# Altium schematic sheet 15 ETHERNET.SchDoc
size 420 x 297 mm; Address1: Address1; Address2: Address2; Address3: Address3; Address4: Address4; DocumentNumber: АБВГ.123456.001 Э3; SheetNumber: 15; SheetTotal: 23; Scale: 1:1; DocumentType: Схема электрическая принципиальная; FirstReferrence: АБВГ.123456.001
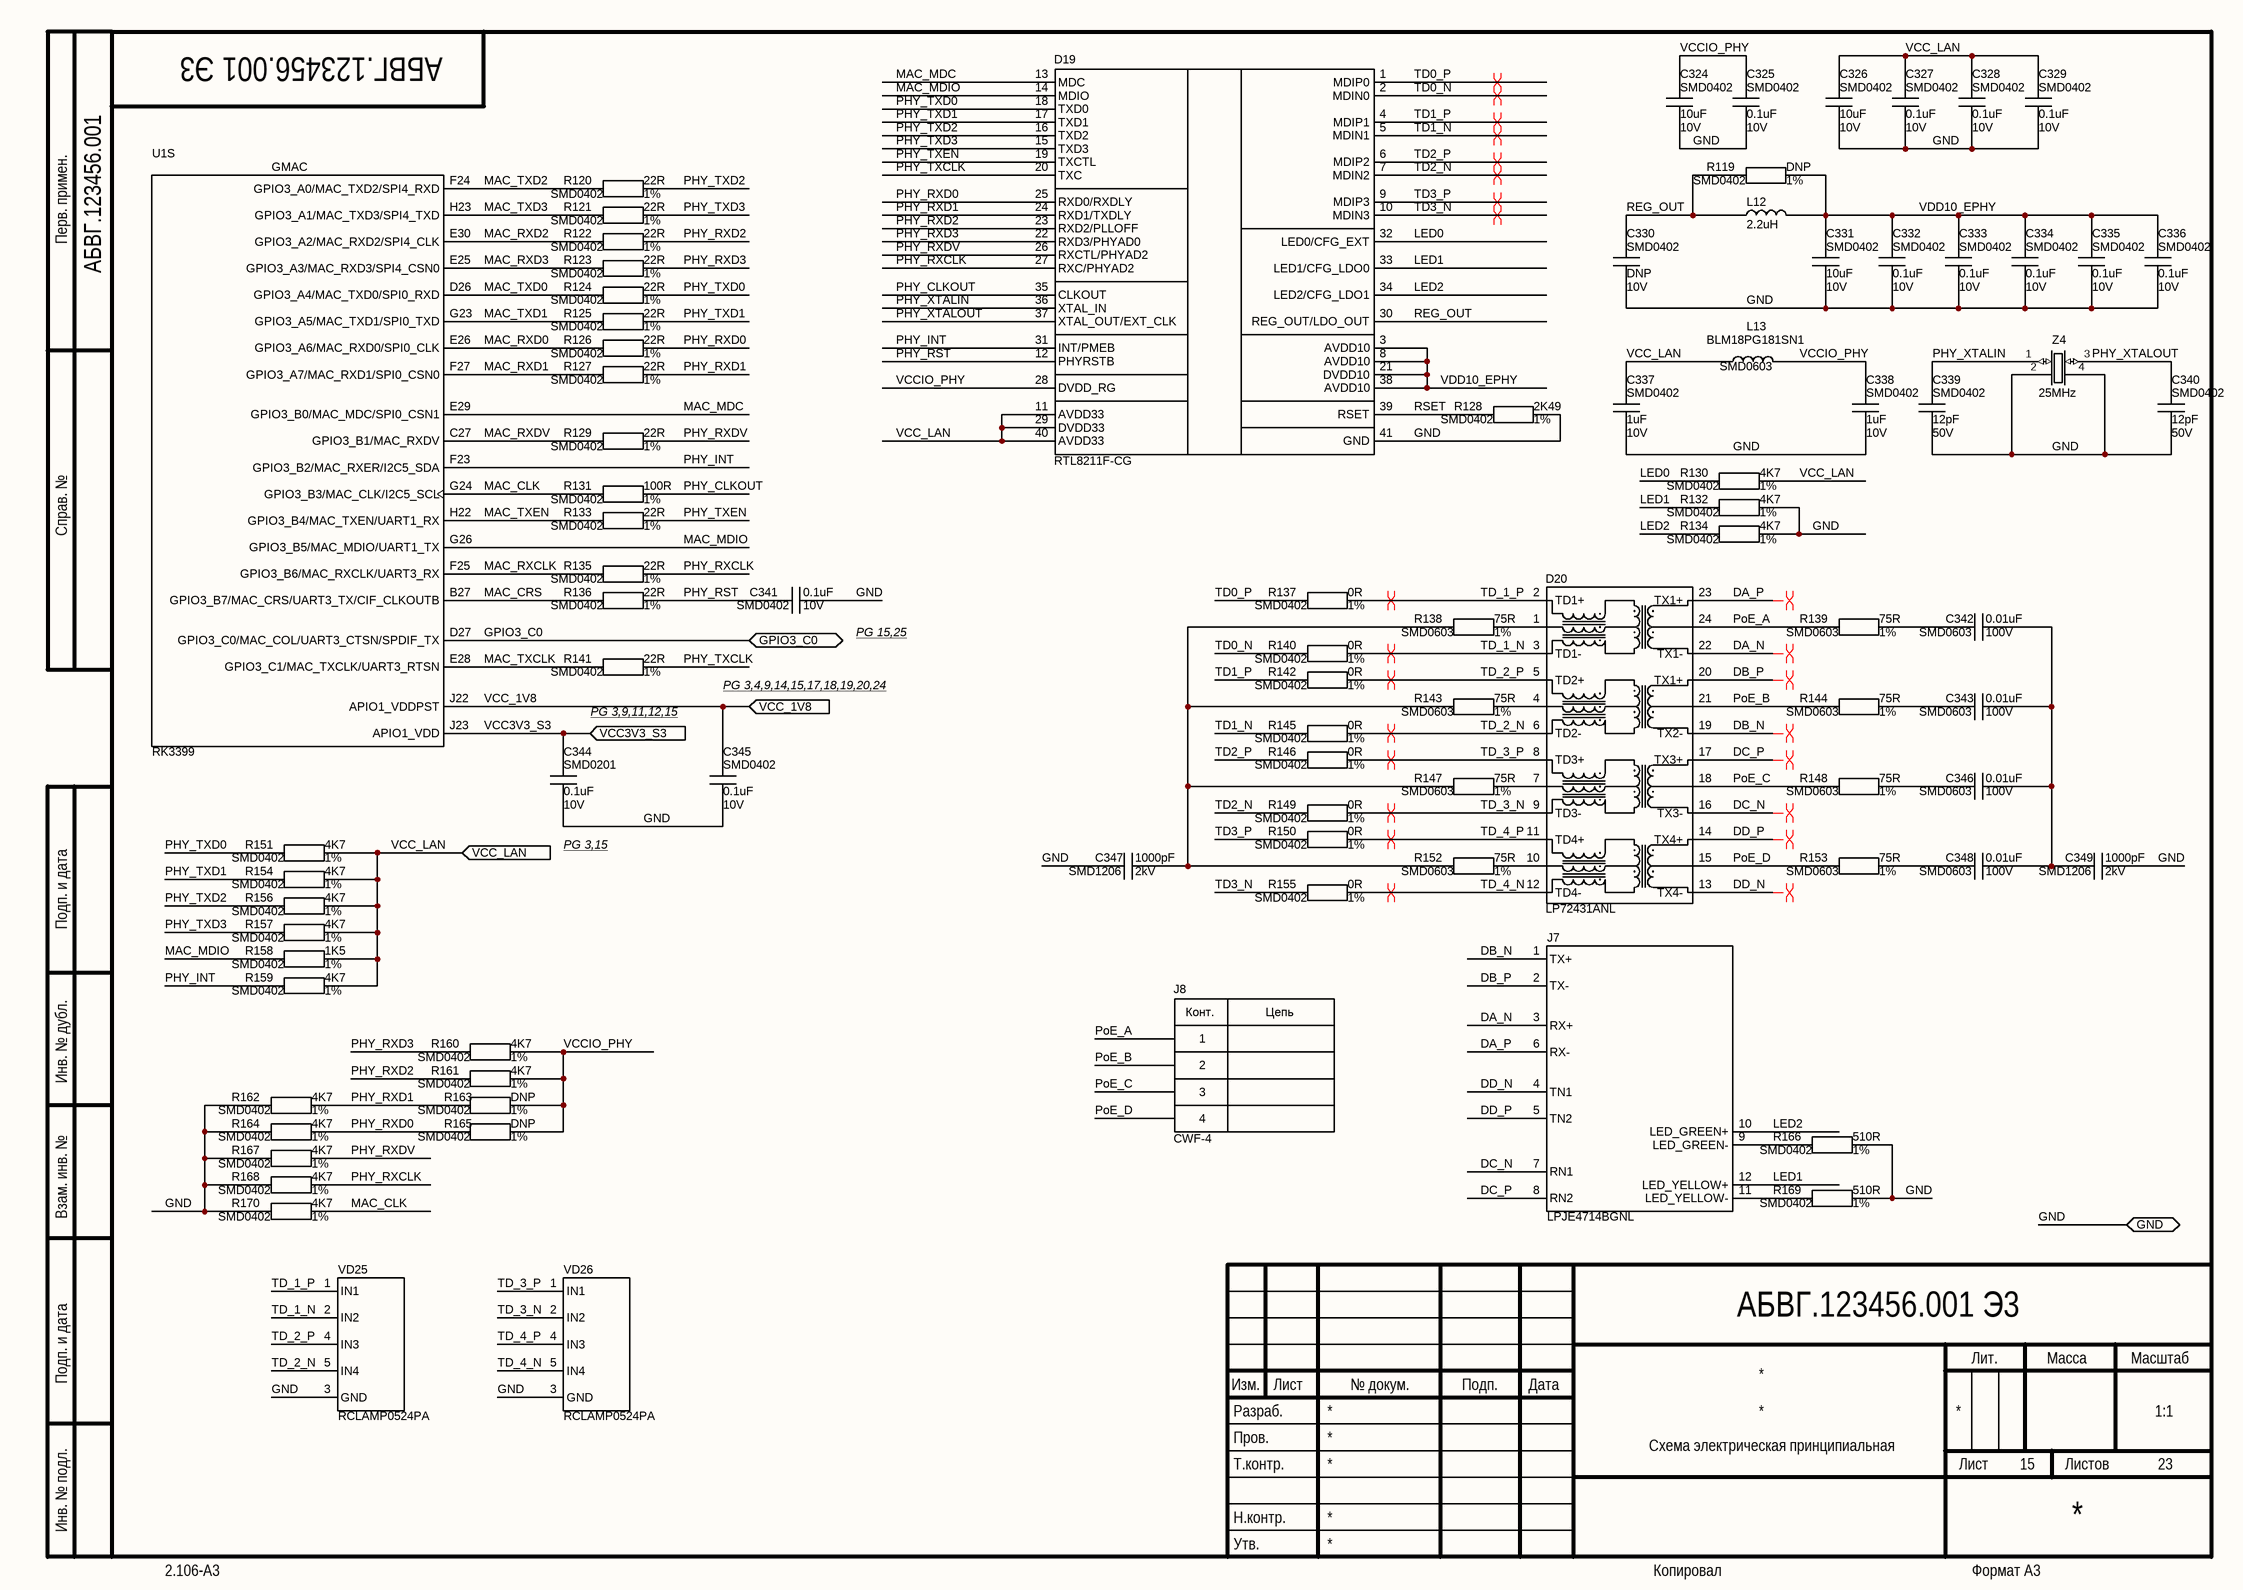
[diagram p0: 15 ETHERNET.SchDoc]

## Parts
C324  Package: SMD0402  Voltage: 10V  [CAP_SMD_0402]  (hidden comment: 10uF)
C325  Package: SMD0402  Voltage: 10V  [CAP_SMD_0402]  (hidden comment: 0.1uF)
C326  Package: SMD0402  Voltage: 10V  [CAP_SMD_0402]  (hidden comment: 10uF)
C327  Package: SMD0402  Voltage: 10V  [CAP_SMD_0402]  (hidden comment: 0.1uF)
C328  Package: SMD0402  Voltage: 10V  [CAP_SMD_0402]  (hidden comment: 0.1uF)
C329  Package: SMD0402  Voltage: 10V  [CAP_SMD_0402]  (hidden comment: 0.1uF)
C330  Package: SMD0402  Voltage: 10V  [CAP_SMD_0402]  (hidden comment: DNP)
C331  Package: SMD0402  Voltage: 10V  [CAP_SMD_0402]  (hidden comment: 10uF)
C332  Package: SMD0402  Voltage: 10V  [CAP_SMD_0402]  (hidden comment: 0.1uF)
C333  Package: SMD0402  Voltage: 10V  [CAP_SMD_0402]  (hidden comment: 0.1uF)
C334  Package: SMD0402  Voltage: 10V  [CAP_SMD_0402]  (hidden comment: 0.1uF)
C335  Package: SMD0402  Voltage: 10V  [CAP_SMD_0402]  (hidden comment: 0.1uF)
C336  Package: SMD0402  Voltage: 10V  [CAP_SMD_0402]  (hidden comment: 0.1uF)
C337  Package: SMD0402  Voltage: 10V  [CAP_SMD_0402]  (hidden comment: 1uF)
C338  Package: SMD0402  Voltage: 10V  [CAP_SMD_0402]  (hidden comment: 1uF)
C339  Package: SMD0402  Voltage: 50V  [CAP_SMD_0402]  (hidden comment: 12pF)
C340  Package: SMD0402  Voltage: 50V  [CAP_SMD_0402]  (hidden comment: 12pF)
C341  Package: SMD0402  Voltage: 10V  [CAP_SMD_0402]  (hidden comment: 0.1uF)
C342  Package: SMD0603  Voltage: 100V  [CAP_SMD_0603]  (hidden comment: 0.01uF)
C343  Package: SMD0603  Voltage: 100V  [CAP_SMD_0603]  (hidden comment: 0.01uF)
C344  Package: SMD0201  Voltage: 10V  [CAP_SMD_0201]  (hidden comment: 0.1uF)
C345  Package: SMD0402  Voltage: 10V  [CAP_SMD_0402]  (hidden comment: 0.1uF)
C346  Package: SMD0603  Voltage: 100V  [CAP_SMD_0603]  (hidden comment: 0.01uF)
C347  Package: SMD1206  Voltage: 2kV  [CAP_SMD_1206]  (hidden comment: 1000pF)
C348  Package: SMD0603  Voltage: 100V  [CAP_SMD_0603]  (hidden comment: 0.01uF)
C349  Package: SMD1206  Voltage: 2kV  [CAP_SMD_1206]  (hidden comment: 1000pF)
D19  RTL8211F-CG  [QFN40]
D20  LP72431ANL  [LP72431ANL]
J7  LPJE4714BGNL  [LPJE4714BGNL]
J8  CWF-4  [CWF-4]
L12  value 2.2uH  [IND_SMD_252012]  (hidden comment: Value)
L13  value BLM18PG181SN1  Package: SMD0603  [IND_SMD_0603]  (hidden comment: Value)
R119  Package: SMD0402  Tolerance: 1%  [RES_SMD_0402]  (hidden comment: DNP)
R120  Package: SMD0402  Tolerance: 1%  [RES_SMD_0402]  (hidden comment: 22R)
R121  Package: SMD0402  Tolerance: 1%  [RES_SMD_0402]  (hidden comment: 22R)
R122  Package: SMD0402  Tolerance: 1%  [RES_SMD_0402]  (hidden comment: 22R)
R123  Package: SMD0402  Tolerance: 1%  [RES_SMD_0402]  (hidden comment: 22R)
R124  Package: SMD0402  Tolerance: 1%  [RES_SMD_0402]  (hidden comment: 22R)
R125  Package: SMD0402  Tolerance: 1%  [RES_SMD_0402]  (hidden comment: 22R)
R126  Package: SMD0402  Tolerance: 1%  [RES_SMD_0402]  (hidden comment: 22R)
R127  Package: SMD0402  Tolerance: 1%  [RES_SMD_0402]  (hidden comment: 22R)
R128  Package: SMD0402  Tolerance: 1%  [RES_SMD_0402]  (hidden comment: 2K49)
R129  Package: SMD0402  Tolerance: 1%  [RES_SMD_0402]  (hidden comment: 22R)
R130  Package: SMD0402  Tolerance: 1%  [RES_SMD_0402]  (hidden comment: 4K7)
R131  Package: SMD0402  Tolerance: 1%  [RES_SMD_0402]  (hidden comment: 100R)
R132  Package: SMD0402  Tolerance: 1%  [RES_SMD_0402]  (hidden comment: 4K7)
R133  Package: SMD0402  Tolerance: 1%  [RES_SMD_0402]  (hidden comment: 22R)
R134  Package: SMD0402  Tolerance: 1%  [RES_SMD_0402]  (hidden comment: 4K7)
R135  Package: SMD0402  Tolerance: 1%  [RES_SMD_0402]  (hidden comment: 22R)
R136  Package: SMD0402  Tolerance: 1%  [RES_SMD_0402]  (hidden comment: 22R)
R137  Package: SMD0402  Tolerance: 1%  [RES_SMD_0402]  (hidden comment: 0R)
R138  Package: SMD0603  Tolerance: 1%  [RES_SMD_0603]  (hidden comment: 75R)
R139  Package: SMD0603  Tolerance: 1%  [RES_SMD_0603]  (hidden comment: 75R)
R140  Package: SMD0402  Tolerance: 1%  [RES_SMD_0402]  (hidden comment: 0R)
R141  Package: SMD0402  Tolerance: 1%  [RES_SMD_0402]  (hidden comment: 22R)
R142  Package: SMD0402  Tolerance: 1%  [RES_SMD_0402]  (hidden comment: 0R)
R143  Package: SMD0603  Tolerance: 1%  [RES_SMD_0603]  (hidden comment: 75R)
R144  Package: SMD0603  Tolerance: 1%  [RES_SMD_0603]  (hidden comment: 75R)
R145  Package: SMD0402  Tolerance: 1%  [RES_SMD_0402]  (hidden comment: 0R)
R146  Package: SMD0402  Tolerance: 1%  [RES_SMD_0402]  (hidden comment: 0R)
R147  Package: SMD0603  Tolerance: 1%  [RES_SMD_0603]  (hidden comment: 75R)
R148  Package: SMD0603  Tolerance: 1%  [RES_SMD_0603]  (hidden comment: 75R)
R149  Package: SMD0402  Tolerance: 1%  [RES_SMD_0402]  (hidden comment: 0R)
R150  Package: SMD0402  Tolerance: 1%  [RES_SMD_0402]  (hidden comment: 0R)
R151  Package: SMD0402  Tolerance: 1%  [RES_SMD_0402]  (hidden comment: 4K7)
R152  Package: SMD0603  Tolerance: 1%  [RES_SMD_0603]  (hidden comment: 75R)
R153  Package: SMD0603  Tolerance: 1%  [RES_SMD_0603]  (hidden comment: 75R)
R154  Package: SMD0402  Tolerance: 1%  [RES_SMD_0402]  (hidden comment: 4K7)
R155  Package: SMD0402  Tolerance: 1%  [RES_SMD_0402]  (hidden comment: 0R)
R156  Package: SMD0402  Tolerance: 1%  [RES_SMD_0402]  (hidden comment: 4K7)
R157  Package: SMD0402  Tolerance: 1%  [RES_SMD_0402]  (hidden comment: 4K7)
R158  Package: SMD0402  Tolerance: 1%  [RES_SMD_0402]  (hidden comment: 1K5)
R159  Package: SMD0402  Tolerance: 1%  [RES_SMD_0402]  (hidden comment: 4K7)
R160  Package: SMD0402  Tolerance: 1%  [RES_SMD_0402]  (hidden comment: 4K7)
R161  Package: SMD0402  Tolerance: 1%  [RES_SMD_0402]  (hidden comment: 4K7)
R162  Package: SMD0402  Tolerance: 1%  [RES_SMD_0402]  (hidden comment: 4K7)
R163  Package: SMD0402  Tolerance: 1%  [RES_SMD_0402]  (hidden comment: DNP)
R164  Package: SMD0402  Tolerance: 1%  [RES_SMD_0402]  (hidden comment: 4K7)
R165  Package: SMD0402  Tolerance: 1%  [RES_SMD_0402]  (hidden comment: DNP)
R166  Package: SMD0402  Tolerance: 1%  [RES_SMD_0402]  (hidden comment: 510R)
R167  Package: SMD0402  Tolerance: 1%  [RES_SMD_0402]  (hidden comment: 4K7)
R168  Package: SMD0402  Tolerance: 1%  [RES_SMD_0402]  (hidden comment: 4K7)
R169  Package: SMD0402  Tolerance: 1%  [RES_SMD_0402]  (hidden comment: 510R)
R170  Package: SMD0402  Tolerance: 1%  [RES_SMD_0402]  (hidden comment: 4K7)
U1  value RK3399  [BGA828C65P31X31_2100X2100X161N]  (hidden comment: RK3399_FF)  (part S of 23)
VD25  RCLAMP0524PA  [RCLAMP0524PA]
VD26  RCLAMP0524PA  [RCLAMP0524PA]
Z4  value 25MHz  [TSX3225]  (hidden comment: Value)

## Ports
GND (bidir), GPIO3_C0 (bidir), VCC3V3_S3 (in), VCC_1V8 (in), VCC_LAN (in)

## Nets
DA_N: D20.22(TX1-) J7.3(RX+)
DA_P: D20.23(TX1+) J7.6(RX-)
DB_N: D20.19(TX2-) J7.1(TX+)
DB_P: D20.20(TX1+) J7.2(TX-)
DC_N: D20.16(TX3-) J7.7(RN1)
DC_P: D20.17(TX3+) J7.8(RN2)
DD_N: D20.13(TX4-) J7.4(TN1)
DD_P: D20.14(TX4+) J7.5(TN2)
GND: C324.2 C325.2 C326.2 C327.2 C328.2 C329.2 C330.2 C331.2 C332.2 C333.2 C334.2 C335.2 C336.2 C337.2 C338.2 C339.2 C340.2 C341.2 C344.2 C345.2 C347.2 C349.1 D19.41(GND) R128.2 R132.2 R134.2 R162.1 R164.1 R166.2 R167.1 R168.1 R169.2 R170.1 VD25.3(GND) VD26.3(GND) Z4.2(GND) Z4.4(GND) ; port GND
GPIO3_C0: U1.D27(GPIO3_C0/MAC_COL/UART3_CTSN/SPDIF_TX) ; port GPIO3_C0
LED0: D19.32(LED0/CFG_EXT) R130.1
LED1: D19.33(LED1/CFG_LDO0) J7.12(LED_YELLOW+) R132.1
LED2: D19.34(LED2/CFG_LDO1) J7.10(LED_GREEN+) R134.1
MAC_CLK: R131.1 R170.2 U1.G24(GPIO3_B3/MAC_CLK/I2C5_SCL)
MAC_CRS: R136.2 U1.B27(GPIO3_B7/MAC_CRS/UART3_TX/CIF_CLKOUTB)
MAC_MDC: D19.13(MDC) U1.E29(GPIO3_B0/MAC_MDC/SPI0_CSN1)
MAC_MDIO: D19.14(MDIO) R158.1 U1.G26(GPIO3_B5/MAC_MDIO/UART1_TX)
MAC_RXCLK: R135.2 U1.F25(GPIO3_B6/MAC_RXCLK/UART3_RX)
MAC_RXD0: R126.2 U1.E26(GPIO3_A6/MAC_RXD0/SPI0_CLK)
MAC_RXD1: R127.2 U1.F27(GPIO3_A7/MAC_RXD1/SPI0_CSN0)
MAC_RXD2: R122.2 U1.E30(GPIO3_A2/MAC_RXD2/SPI4_CLK)
MAC_RXD3: R123.2 U1.E25(GPIO3_A3/MAC_RXD3/SPI4_CSN0)
MAC_RXDV: R129.2 U1.C27(GPIO3_B1/MAC_RXDV)
MAC_TXCLK: R141.2 U1.E28(GPIO3_C1/MAC_TXCLK/UART3_RTSN)
MAC_TXD0: R124.2 U1.D26(GPIO3_A4/MAC_TXD0/SPI0_RXD)
MAC_TXD1: R125.2 U1.G23(GPIO3_A5/MAC_TXD1/SPI0_TXD)
MAC_TXD2: R120.2 U1.F24(GPIO3_A0/MAC_TXD2/SPI4_RXD)
MAC_TXD3: R121.2 U1.H23(GPIO3_A1/MAC_TXD3/SPI4_TXD)
MAC_TXEN: R133.2 U1.H22(GPIO3_B4/MAC_TXEN/UART1_RX)
PHY_CLKOUT: D19.35(CLKOUT) R131.2
PHY_INT: D19.31(INT/PMEB) R159.1 U1.F23(GPIO3_B2/MAC_RXER/I2C5_SDA)
PHY_RST: C341.1 D19.12(PHYRSTB) R136.1
PHY_RXCLK: D19.27(RXC/PHYAD2) R135.1 R168.2
PHY_RXD0: D19.25(RXD0/RXDLY) R126.1 R164.2 R165.1
PHY_RXD1: D19.24(RXD1/TXDLY) R127.1 R162.2 R163.1
PHY_RXD2: D19.23(RXD2/PLLOFF) R122.1 R161.1
PHY_RXD3: D19.22(RXD3/PHYAD0) R123.1 R160.1
PHY_RXDV: D19.26(RXCTL/PHYAD2) R129.1 R167.2
PHY_TXCLK: D19.20(TXC) R141.1
PHY_TXD0: D19.18(TXD0) R124.1 R151.1
PHY_TXD1: D19.17(TXD1) R125.1 R154.1
PHY_TXD2: D19.16(TXD2) R120.1 R156.1
PHY_TXD3: D19.15(TXD3) R121.1 R157.1
PHY_TXEN: D19.19(TXCTL) R133.1
PHY_XTALIN: C339.1 D19.36(XTAL_IN) Z4.1(IN/OUT)
PHY_XTALOUT: C340.1 D19.37(XTAL_OUT/EXT_CLK) Z4.3(IN/OUT)
PoE_A: D20.24(TCT_1) J8.1 R139.1
PoE_B: D20.21(TCT_2) J8.2 R144.1
PoE_C: D20.18(TCT_3) J8.3 R148.1
PoE_D: D20.15(TCT_4) J8.4 R153.1
REG_OUT: C330.1 D19.30(REG_OUT/LDO_OUT) L12.2 R119.1
RSET: D19.39(RSET) R128.1
TD0_N: D19.2(MDIN0) R140.1
TD0_P: D19.1(MDIP0) R137.1
TD1_N: D19.5(MDIN1) R145.1
TD1_P: D19.4(MDIP1) R142.1
TD2_N: D19.7(MDIN2) R149.1
TD2_P: D19.6(MDIP2) R146.1
TD3_N: D19.10(MDIN3) R155.1
TD3_P: D19.9(MDIP3) R150.1
TD_1_N: D20.3(TD1-) R140.2 VD25.2(IN2)
TD_1_P: D20.2(TD1+) R137.2 VD25.1(IN1)
TD_2_N: D20.6(TD2-) R145.2 VD25.5(IN4)
TD_2_P: D20.5(TD2+) R142.2 VD25.4(IN3)
TD_3_N: D20.9(TD3-) R149.2 VD26.2(IN2)
TD_3_P: D20.8(TD3+) R146.2 VD26.1(IN1)
TD_4_N: D20.12(TD4-) R155.2 VD26.5(IN4)
TD_4_P: D20.11(TD4+) R150.2 VD26.4(IN3)
VCC3V3_S3: C344.1 U1.J23(APIO1_VDD) ; port VCC3V3_S3
VCC_1V8: C345.1 U1.J22(APIO1_VDDPST) ; port VCC_1V8
VCC_LAN: C326.1 C327.1 C328.1 C329.1 C337.1 D19.11(AVDD33) D19.29(DVDD33) D19.40(AVDD33) L13.2 R130.2 R151.2 R154.2 R156.2 R157.2 R158.2 R159.2 ; port VCC_LAN
VCCIO_PHY: C324.1 C325.1 C338.1 D19.28(DVDD_RG) L13.1 R160.2 R161.2 R163.2 R165.2
VDD10_EPHY: C331.1 C332.1 C333.1 C334.1 C335.1 C336.1 D19.3(AVDD10) D19.8(AVDD10) D19.21(DVDD10) D19.38(AVDD10) L12.1 R119.2
NetC342_1: C342.1 C343.1 C346.1 C348.1 C349.2
NetC342_2: C342.2 R139.2
NetC343_2: C343.2 R144.2
NetC346_2: C346.2 R148.2
NetC347_1: C347.1 R138.2 R143.2 R147.2 R152.2
NetC348_2: C348.2 R153.2
NetD20_1: D20.1(TCT1) R138.1
NetD20_4: D20.4(TCT2) R143.1
NetD20_7: D20.7(TCT3) R147.1
NetD20_10: D20.10(TCT4) R152.1
NetJ7_9: J7.9(LED_GREEN-) R166.1
NetJ7_11: J7.11(LED_YELLOW-) R169.1

## Layout directives
differential pair; differential pair class DiffPair_1; net class DiffPair_1: DA_N, DA_P, DB_N, DB_P, DC_N, DC_P, DD_N, DD_P, TD0_N, TD0_P, TD1_N, TD1_P, TD2_N, TD2_P, TD3_N, TD3_P, TD_1_N, TD_1_P, TD_2_N, TD_2_P, TD_3_N, TD_3_P, TD_4_N, TD_4_P

## Notes on the sheet
- Перв. примен.
- Справ. №
- PG 15,25
- PG 3,9,11,12,15
- PG 3,4,9,14,15,17,18,19,20,24
- PG 3,15
- Подп. и дата
- Инв. № дубл.
- Взам. инв. №
- Разраб.
- Изм.
- Лист
- № докум.
- Подп.
- Дата
- Лит.
- Масса
- Масштаб
- Пров.
- Т.контр.
- Листов
- Инв. № подл.
- Утв.
- Н.контр.
- 2.106-A3
- Копировал
- Формат А3
- (in symbol CON4) Конт.; Цепь
- (in symbol RK3399_FF, part S) GMAC

## Library data of the parts
C324 C326 C331 = Ceramic_Cap: PartNumber: CC0402MRX5R6BB106; ComponentType: SMD Ceramic Chip Capacitor; Manufacter: *; Tolerance: *; ClassName: *; Value: 10uF
C325 C327-C330 C332-C336 C341 C345 = Ceramic_Cap: PartNumber: CC0402KRX5R6BB104; ComponentType: SMD Ceramic Chip Capacitor; Manufacter: *; Tolerance: *; ClassName: *
  C325 C327-C329 C332-C336 C341 C345: Value: 0.1uF
  C330: Value: DNP
C337 C338 = Ceramic_Cap: PartNumber: CC0402KRX5R6BB105; ComponentType: SMD Ceramic Chip Capacitor; Manufacter: *; Tolerance: *; ClassName: *; Value: 1uF
C339 C340 = Ceramic_Cap: PartNumber: CC0402JRNPO9BN120; ComponentType: SMD Ceramic Chip Capacitor; Manufacter: *; Tolerance: *; ClassName: *; Value: 12pF
C342 C343 C346 C348 = Ceramic_Cap: PartNumber: CC0603KRX7R0BB103; ComponentType: SMD Ceramic Chip Capacitor; Manufacter: *; Tolerance: *; ClassName: *; Value: 0.01uF
C344 = Ceramic_Cap: PartNumber: CC0201KRX5R6BB104; ComponentType: SMD Ceramic Chip Capacitor; Manufacter: *; Tolerance: *; ClassName: *; Value: 0.1uF
C347 C349 = Ceramic_Cap: PartNumber: CC1206MKX7RDBB102; ComponentType: SMD Ceramic Chip Capacitor; Manufacter: *; Tolerance: *; ClassName: *; Value: 1000pF
J8 = CON4: PartNumber: DS1069-4MVW6X (CWF-4); Manufacter: *; Package: CWF-4; ClassName: *; Value: CWF-4
L12 = Inductor_smal: PartNumber: DFE252012P-2R2M=P2; ComponentType: *; Manufacter: *; Package: SMD252012; ClassName: *
L13 = Inductor_smal: ComponentType: *; Manufacter: *; PartNumber: BLM18PG181SN1; ClassName: *
R119 R163 R165 = Chip_Res: PartNumber: Do Not Place; ComponentType: SMD Chip Resistor; Manufacter: *; Voltage: *; ClassName: *; Value: DNP
R120-R127 R129 R133 R135 R136 R141 = Chip_Res: PartNumber: RC0402FR-0722RL; ComponentType: SMD Chip Resistor; Manufacter: *; Voltage: *; ClassName: *; Value: 22R
R128 = Chip_Res: PartNumber: RC0402FR-072K49L; ComponentType: SMD Chip Resistor; Manufacter: *; Voltage: *; ClassName: *; Value: 2K49
R130 R132 R134 R151 R154 R156 R157 R159-R162 R164 R167 R168 R170 = Chip_Res: PartNumber: RC0402FR-074K7L; ComponentType: SMD Chip Resistor; Manufacter: *; Voltage: *; ClassName: *; Value: 4K7
R131 = Chip_Res: PartNumber: RC0402FR-07100RL; ComponentType: SMD Chip Resistor; Manufacter: *; Voltage: *; ClassName: *; Value: 100R
R137 R140 R142 R145 R146 R149 R150 R155 = Chip_Res: PartNumber: RC0402FR-070RL; ComponentType: SMD Chip Resistor; Manufacter: *; Voltage: *; ClassName: *; Value: 0R
R138 R139 R143 R144 R147 R148 R152 R153 = Chip_Res: PartNumber: RC0603FR-0775RL; ComponentType: SMD Chip Resistor; Manufacter: *; Voltage: *; ClassName: *; Value: 75R
R158 = Chip_Res: PartNumber: RC0402FR-071K5L; ComponentType: SMD Chip Resistor; Manufacter: *; Voltage: *; ClassName: *; Value: 1K5
R166 R169 = Chip_Res: PartNumber: RC0402FR-07510RL; ComponentType: SMD Chip Resistor; Manufacter: *; Voltage: *; ClassName: *; Value: 510R
Z4 = OSC3225: PartNumber: X322525MOB4SI; ComponentType: *; Manufacter: *; Package: TSX3225
D19 = RTL8211F-CG: ComponentType: SMD Chip Resistor; Manufacter: *; Voltage: *; ClassName: *; Tolerance: *; PartNumber: RTL8211F-CG; Package: QFN40; Value: RTL8211F-CG
D20 = LP72431ANL: ComponentType: *; Manufacter: *; Voltage: *; ClassName: *; Tolerance: *; PartNumber: LP72431ANL; Package: LP72431ANL; Value: LP72431ANL
J7 = LPJE4714BGNL: ComponentType: *; Manufacter: *; Voltage: *; ClassName: *; Tolerance: *; PartNumber: LPJE4714BGNL; Package: LPJE4714BGNL; Value: LPJE4714BGNL
U1 = RK3399_FF: Package: BGA828; ComponentType: *; Manufacter: *; PartNumber: RK3399; ClassName: *
VD25 VD26 = RCLAMP0524PA: ComponentType: *; Manufacter: *; Package: RCLAMP0524PA; PartNumber: RCLAMP0524PA; ClassName: *; Value: RCLAMP0524PA